# EAGLE design boarduino_2 (EAGLE 8.3.2)
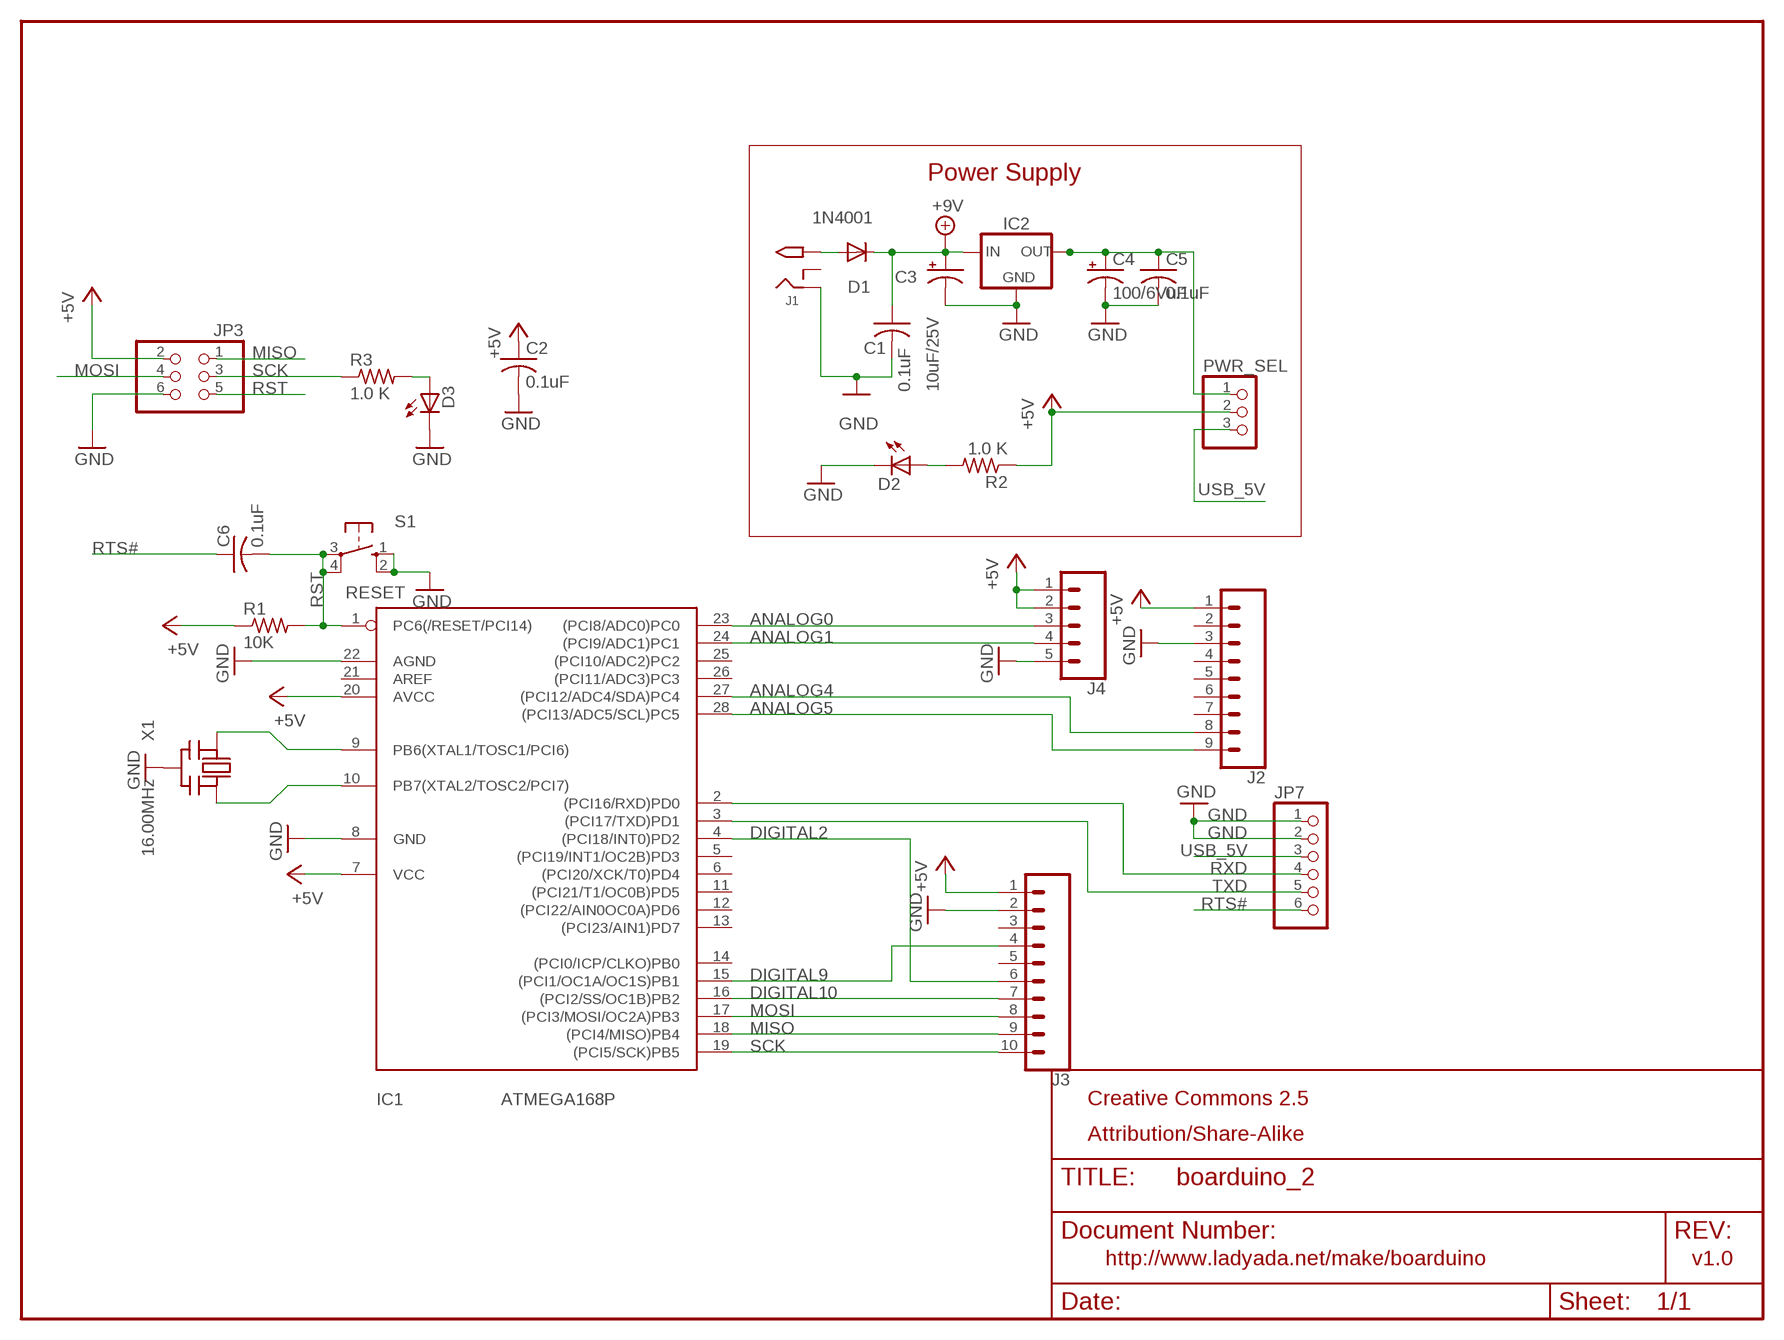
[diagram p0: schematic, sheet 1]

## Parts
C1  0.1uF  C-US025-025X050  [C025-025X050]
C2  0.1uF  C-US025-025X050  [C025-025X050]
C3  10uF/25V  CPOL-USE2.5-6  [E2,5-6]
C4  100/6VuF  CPOL-USE2.5-6  [E2,5-6]
C5  0.1uF  C-US025-025X050  [C025-025X050]
C6  0.1uF  C-US025-025X050  [C025-025X050]
D1  1N4001  1N4004  [DO41-10]
D2  LED3MM  [LED3MM]
D3  Green  LED3MM  [LED3MM]
IC1  ATMEGA168P  ATMEGA168PROUND  [DIL28/3]
IC2  78XXS  [78XXS]
J1  2.1MMJACK  [PJ-102A]
J2  CONN_09  [1X09]
J3  CONN_10"  [1X10]
J4  CONN_05  [1X05]
JP3  PINHD-2X3  [2X03]
JP7  PINHD-1X6CLEAN  [1X06-CLEAN]
PWR_SEL  PINHD-1X3  [1X03]
R1  10K  R-US_0207/5V  [0207/5V]
R2  1.0 K  R-US_0207/5V  [0207/5V]
R3  1.0 K  R-US_0207/5V  [0207/5V]
S1  RESET  10-XX  [B3F-10XX]
X1  16.00MHz  CERMOSCILL  [CERM_OSC]

## Nets
+5V: C2.1 IC1.7(VCC) IC1.20(AVCC) J2.1 J3.1 J4.1 J4.2 JP3.2 PWR_SEL.2 R1.1 R2.1
+9V: C1.1 C3.+ D1.C IC2.IN
ANALOG0: IC1.23((PCI8/ADC0)PC0) J4.3
ANALOG1: IC1.24((PCI9/ADC1)PC1) J4.4
ANALOG4: IC1.27((PCI12/ADC4/SDA)PC4) J2.8
ANALOG5: IC1.28((PCI13/ADC5/SCL)PC5) J2.9
DIGITAL2: IC1.4((PCI18/INT0)PD2) J3.6
DIGITAL9: IC1.15((PCI1/OC1A/OC1S)PB1) J3.4
DIGITAL10: IC1.16((PCI2/SS/OC1B)PB2) J3.7
GND: C1.2 C2.2 C3.- C4.- C5.2 D2.K(C) D3.K(C) IC1.8(GND) IC1.22(AGND) IC2.GND J1.RING J2.3 J3.2 J4.5 JP3.6 JP7.1 JP7.2 S1.1(S) S1.2(S1) X1.P$2(GND)
MISO: IC1.18((PCI4/MISO)PB4) J3.9 JP3.1
MOSI: IC1.17((PCI3/MOSI/OC2A)PB3) J3.8 JP3.4
N$1: IC1.9(PB6(XTAL1/TOSC1/PCI6)) X1.P$1(IN)
N$2: IC1.10(PB7(XTAL2/TOSC2/PCI7)) X1.P$3(OUT)
N$3: D2.A R2.2
N$4: D3.A R3.2
N$17: D1.A J1.TIP
N$22: C4.+ C5.1 IC2.OUT PWR_SEL.1
RST: C6.2 IC1.1(PC6(/RESET/PCI14)) JP3.5 R1.2 S1.3(P) S1.4(P1)
RTS#: C6.1 JP7.6
RXD: IC1.2((PCI16/RXD)PD0) JP7.4
SCK: IC1.19((PCI5/SCK)PB5) J3.10 JP3.3 R3.1
TXD: IC1.3((PCI17/TXD)PD1) JP7.5
USB_5V: JP7.3 PWR_SEL.3
Unconnected: IC1.5((PCI19/INT1/OC2B)PD3) IC1.6((PCI20/XCK/T0)PD4) IC1.11((PCI21/T1/OC0B)PD5) IC1.12((PCI22/AIN0OC0A)PD6) IC1.13((PCI23/AIN1)PD7) IC1.14((PCI0/ICP/CLKO)PB0) IC1.21(AREF) IC1.25((PCI10/ADC2)PC2) IC1.26((PCI11/ADC3)PC3) J1.RING_SW J2.2 J2.4 J2.5 J2.6 J2.7 J3.3 J3.5

## Notes on the sheet
- Power Supply
- Creative Commons 2.5
- Attribution/Share-Alike
- http://www.ladyada.net/make/boarduino | v1.0

## Library data of the parts
C1 C2 C5 C6 = minimidi:C-US: CAPACITOR, American symbol
C3 C4 = minimidi:CPOL-US: POLARIZED CAPACITOR, American symbol
D1 = minimidi:1N4004: DIODE general purpose rectifier, 1 A
D2 D3 = minimidi:LED: LED OSRAM: - CHIPLED LG R971, LG N971, LY N971, LG Q971, LY Q971, LO R971, LY R971 LH N974, LH R974 LS Q976, LO Q976, LY Q976 LO Q996 - Hyper CHIPLED LW Q18S LB Q993, LB Q99A, LB R99A - SideLED LS A670, LO A670, LY A670, LG A670, LP A670 LB A673, LV A673, LT A673, LW A673 LH A674 LY A675 LS A676, LA A676, LO A676, LY A676, LW A676 LS A679, LY A679, LG A679 - Hyper Micro SIDELED® LS Y876, LA Y876, LO Y876, LY Y876 LT Y87S - SmartLED LW L88C, LW L88S LB L89C, LB L89S, LG L890 LS L89K, LO L89K, LY L89K LS L896, LA L896, LO L896, LY L896 - TOPLED LS T670, LO T670, LY T670, LG T670, LP T670 LSG T670, LSP T670, LSY T670, LOP T670, LYG T670 LG T671, LOG T671, LSG T671 LB T673, LV T673, LT T673, LW T673 LH T674 LS T676, LA T676, LO T676, LY T676, LB T676, LH T676, LSB T676, LW T676 LB T67C, LV T67C, LT T67C, LS T67K, LO T67K, LY T67K, LW E67C LS E67B, LA E67B, LO E67B, LY E67B, LB E67C, LV E67C, LT E67C LW T67C LS T679, LY T679, LG T679 LS T770, LO T770, LY T770, LG T770, LP T770 LB T773, LV T773, LT T773, LW T773 LH T774 LS E675, LA E675, LY E675, LS T675 LS T776, LA T776, LO T776, LY T776, LB T776 LHGB T686 LT T68C, LB T68C - Hyper Mini TOPLED® LB M676 - Mini TOPLED Santana® LG M470 LS M47K, LO M47K, LY M47K Source: http://www.osram.convergy.de/
IC1 = avr:ATMEGA168*P: MICROCONTROLLER 16 kBytes FLASH 1 kBytes SRAM 512 Bytes EEPROM USART 8-channel 10 bit ADC
IC2 = v-reg:78XXS: VOLTAGE REGULATOR
J1 = minimidi:2.1MMJACK
J2 = SparkFun-Connectors:CONN_09: Multi connection point. Often used as Generic Header-pin footprint for 0.1 inch spaced/style header connections On any of the 0.1 inch spaced packages, you can populate with these: Break Away Headers - Straight <https://www.sparkfun.com/products/116> (PRT-00116) Break Away Male Headers - Right Angle <https://www.sparkfun.com/products/553> (PRT-00553) Female Headers <https://www.sparkfun.com/products/115> (PRT-00115) Break Away Headers - Machine Pin <https://www.sparkfun.com/products/117> (PRT-00117) Break Away Female Headers - Swiss Machine Pin <https://www.sparkfun.com/products/743> (PRT-00743) For SCREWTERMINALS and SPRING TERMINALS visit here: Screw Terimnals on SparkFun.com <https://www.sparkfun.com/search/results?term=Screw+Terminals> (5mm/3.5mm/2.54mm spacing) This device is also useful as a general connection point to wire up your design to another part of your project. Our various solder wires solder well into these plated through hole pads. Hook-Up Wire - Assortment (Stranded, 22 AWG) <https://www.sparkfun.com/products/11375> (PRT-11375) Hook-Up Wire - Assortment (Solid Core, 22 AWG) <https://www.sparkfun.com/products/11367> (PRT-11367) View the entire wire category on our website here <https://www.sparkfun.com/categories/141> Special notes: Molex polarized connector foot print use with SKU : PRT-08231 with associated crimp pins and housings. 1MM SMD Version SKU: PRT-10208 NOTES ON THE VARIANTS LOCK and LOCK_LONGPADS... This footprint was designed to help hold the alignment of a through-hole component (i.e. 6-pin header) while soldering it into place. You may notice that each hole has been shifted either up or down by 0.005 of an inch from it's more standard position (which is a perfectly straight line). This slight alteration caused the pins (the squares in the middle) to touch the edges of the holes. Because they are alternating, it causes a "brace" to hold the component in place. 0.005 has proven to be the perfect amount of "off-center" position when using our standard breakaway headers. Although looks a little odd when you look at the bare footprint, once you have a header in there, the alteration is very hard to notice. Also,if you push a header all the way into place, it is covered up entirely on the bottom side.
J3 = SparkFun-Connectors:CONN_10: Multi connection point. Often used as Generic Header-pin footprint for 0.1 inch spaced/style header connections On any of the 0.1 inch spaced packages, you can populate with these: Break Away Headers - Straight <https://www.sparkfun.com/products/116> (PRT-00116) Break Away Male Headers - Right Angle <https://www.sparkfun.com/products/553> (PRT-00553) Female Headers <https://www.sparkfun.com/products/115> (PRT-00115) Break Away Headers - Machine Pin <https://www.sparkfun.com/products/117> (PRT-00117) Break Away Female Headers - Swiss Machine Pin <https://www.sparkfun.com/products/743> (PRT-00743) Arduino Stackable Header - 10 Pin <https://www.sparkfun.com/products/11376> (PRT-11376) For SCREWTERMINALS and SPRING TERMINALS visit here: Screw Terimnals on SparkFun.com <https://www.sparkfun.com/search/results?term=Screw+Terminals> (5mm/3.5mm/2.54mm spacing) This device is also useful as a general connection point to wire up your design to another part of your project. Our various solder wires solder well into these plated through hole pads. Hook-Up Wire - Assortment (Stranded, 22 AWG) <https://www.sparkfun.com/products/11375> (PRT-11375) Hook-Up Wire - Assortment (Solid Core, 22 AWG) <https://www.sparkfun.com/products/11367> (PRT-11367) View the entire wire category on our website here <https://www.sparkfun.com/categories/141> Special notes: Molex polarized connector foot print use with SKU : PRT-08231 with associated crimp pins and housings. 1MM SMD Version SKU: PRT-10208 NOTES ON THE VARIANTS LOCK and LOCK_LONGPADS... This footprint was designed to help hold the alignment of a through-hole component (i.e. 6-pin header) while soldering it into place. You may notice that each hole has been shifted either up or down by 0.005 of an inch from it's more standard position (which is a perfectly straight line). This slight alteration caused the pins (the squares in the middle) to touch the edges of the holes. Because they are alternating, it causes a "brace" to hold the component in place. 0.005 has proven to be the perfect amount of "off-center" position when using our standard breakaway headers. Although looks a little odd when you look at the bare footprint, once you have a header in there, the alteration is very hard to notice. Also,if you push a header all the way into place, it is covered up entirely on the bottom side.; PROD_ID: CONN-11563
J4 = SparkFun-Connectors:CONN_05: Multi connection point. Often used as Generic Header-pin footprint for 0.1 inch spaced/style header connections On any of the 0.1 inch spaced packages, you can populate with these: Break Away Headers - Straight <https://www.sparkfun.com/products/116> (PRT-00116) Break Away Male Headers - Right Angle <https://www.sparkfun.com/products/553> (PRT-00553) Female Headers <https://www.sparkfun.com/products/115> (PRT-00115) Break Away Headers - Machine Pin <https://www.sparkfun.com/products/117> (PRT-00117) Break Away Female Headers - Swiss Machine Pin <https://www.sparkfun.com/products/743> (PRT-00743) For SCREWTERMINALS and SPRING TERMINALS visit here: Screw Terimnals on SparkFun.com <https://www.sparkfun.com/search/results?term=Screw+Terminals> (5mm/3.5mm/2.54mm spacing) This device is also useful as a general connection point to wire up your design to another part of your project. Our various solder wires solder well into these plated through hole pads. Hook-Up Wire - Assortment (Stranded, 22 AWG) <https://www.sparkfun.com/products/11375> (PRT-11375) Hook-Up Wire - Assortment (Solid Core, 22 AWG) <https://www.sparkfun.com/products/11367> (PRT-11367) View the entire wire category on our website here <https://www.sparkfun.com/categories/141> Special notes: Molex polarized connector foot print use with SKU : PRT-08231 with associated crimp pins and housings. 1MM SMD Version SKU: PRT-10208
JP3 = pinhead-ez:PINHD-2X3: PIN HEADER
JP7 = carduino:PINHD-1X6: PIN HEADER
PWR_SEL = pinhead:PINHD-1X3: PIN HEADER
R1 = rcl-ez:R-US_: RESISTOR, American symbol
R2 R3 = minimidi:R-US_: RESISTOR, American symbol
S1 = switch-omron:10-XX: OMRON SWITCH
X1 = digg:CERMOSCILL

## Board
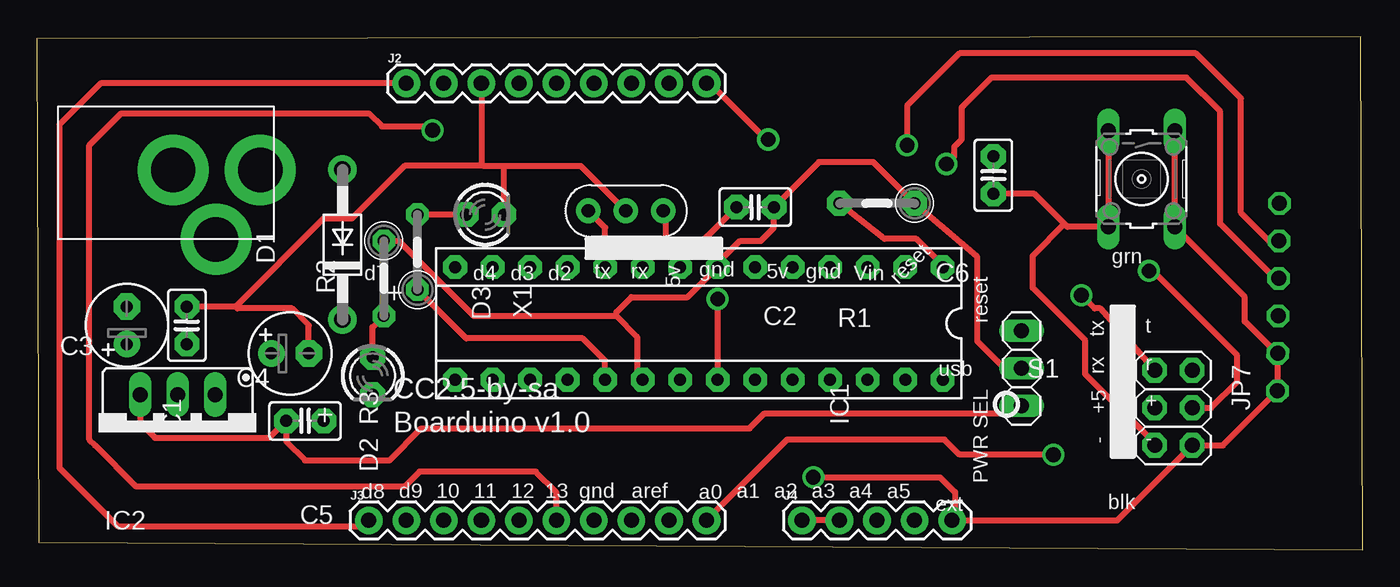
[diagram p1: board, top side]
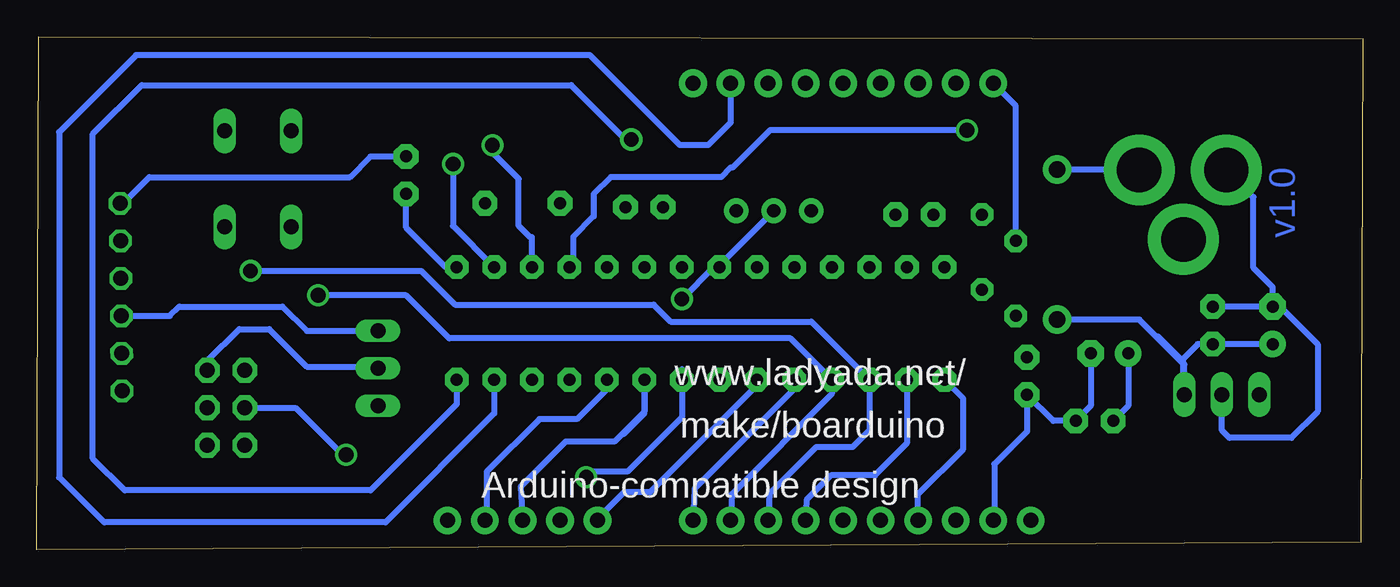
[diagram p2: board, bottom side, seen from below]

Size 89.77 x 34.72 mm. Coordinates in mm from the lower left corner, seen from the top.
Outline: 0.13,0.51 89.77,0 89.64,34.72 0,34.59 0.13,0.51
Copper layers (1*16): Top 0.035mm / dielectric 1.5mm / Bottom 0.035mm
Design rules "default": minimum track width 10mil, minimum drill 19mil, track to track 10mil, track to pad 10mil, pad to pad 10mil, via to via 10mil, smd to smd 0mil, copper to edge 10mil, drill to drill 8mil, minimum pad ring 10mil, minimum via ring 8mil, stop-mask expansion 4mil, vias tented up to drill 0mil, thermal gap 10mil

### Footprints (pad centres in the part's own frame; a part is rotated, then mirrored left to right if it is on the bottom)
C025-025X050 = drill 0.813 pad 1.676 octagon: 1 -1.27,0; 2 1.27,0
E2,5-6 = drill 0.813 pad 1.778: + -1.27,0 | drill 0.813 pad 1.778 octagon: - 1.27,0
DO41-10 = drill 1.118 pad 1.93: A 5.08,0; C -5.08,0
LED3MM = drill 0.813 pad 1.676 octagon: A -1.27,0; K 1.27,0
DIL28/3 = drill 0.813 pad 1.6 octagon: 1 -16.51,-3.81; 2 -13.97,-3.81; 3 -11.43,-3.81; 4 -8.89,-3.81; 5 -6.35,-3.81; 6 -3.81,-3.81; 7 -1.27,-3.81; 8 1.27,-3.81; 9 3.81,-3.81; 10 6.35,-3.81; 11 8.89,-3.81; 12 11.43,-3.81; 13 13.97,-3.81; 14 16.51,-3.81; 15 16.51,3.81; 16 13.97,3.81; 17 11.43,3.81; 18 8.89,3.81; 19 6.35,3.81; 20 3.81,3.81; 21 1.27,3.81; 22 -1.27,3.81; 23 -3.81,3.81; 24 -6.35,3.81; 25 -8.89,3.81; 26 -11.43,3.81; 27 -13.97,3.81; 28 -16.51,3.81
78XXS = drill 1.016 long: GND 0,-2.54; IN -2.54,-2.54; OUT 2.54,-2.54
PJ-102A = drill 3 pad 4.8: RING 0.1,-3.39; RING_SW -4.6,-6.29; TIP 0.1,-9.29
1X09 = drill 1.016 pad 1.88: 1 0,0; 2 2.54,0; 3 5.08,0; 4 7.62,0; 5 10.16,0; 6 12.7,0; 7 15.24,0; 8 17.78,0; 9 20.32,0
1X10 = drill 1.016 pad 1.88: 1 0,0; 2 2.54,0; 3 5.08,0; 4 7.62,0; 5 10.16,0; 6 12.7,0; 7 15.24,0; 8 17.78,0; 9 20.32,0; 10 22.86,0
1X05 = drill 1.016 pad 1.88: 1 0,0; 2 2.54,0; 3 5.08,0; 4 7.62,0; 5 10.16,0
2X03 = drill 1.016 pad 1.676 octagon: 1 -2.54,-1.27; 2 -2.54,1.27; 3 0,-1.27; 4 0,1.27; 5 2.54,-1.27; 6 2.54,1.27
1X06-CLEAN = drill 1.016 octagon: 1 -6.35,0; 2 -3.81,0; 3 -1.27,0; 4 1.27,0; 5 3.81,0; 6 6.35,0
1X03 = drill 1.016 long: 1 -2.54,0; 2 0,0; 3 2.54,0
0207/5V = drill 0.813 pad 1.676 octagon: 1 -2.54,0; 2 2.54,0
0207/5V' = drill 0.813 pad 1.524 octagon: 1 -2.54,0; 2 2.54,0
B3F-10XX = drill 1.016 long: 1 -3.251,2.261; 2 3.251,2.261; 3 -3.251,-2.261; 4 3.251,-2.261
CERM_OSC = drill 0.9 pad 1.676: P$1 -2.54,0; P$2 0,0; P$3 2.54,0

### Placement (x,y rotation side)
C1  10.16,15.2 90 top
C2  48.64,23.2 180 top
C3  6.09,15.2 90 top
C4  17.14,13.3 0 top
C5  18.16,8.72 0 top
C6  64.77,25.36 270 top
D1  20.7,20.66 90 top
D2  22.73,11.77 270 top
D3  30.35,22.7 0 top
IC1  44.83,15.33 180 top
IC2  9.52,7.96 180 top
J1  5.84,25.62 90 top
J2  25.01,31.59 0 top
J3  22.47,1.99 0 top
J4  51.81,1.99 0 top
JP3  76.96,9.61 270 top
JP7  84.07,17.11 89.4 top
PWR_SEL  66.67,12.28 90 top
R1  56.89,23.46 180 top
R2  1.0 K  [0207/5V']  23.49,18.38 270 top
R3  1.0 K  [0207/5V']  25.78,20.15 90 top
S1  74.8,25.11 270 top
X1  39.87,22.95 180 top

### Tracks (layer width: path | path; a pad name or v marks a point on that pad's centre or on a via)
+5V
  Top 0.305: 46.1,19.39 IC1.7
  Top 0.406: J4.2 J4.1 | R2.1 24.51,20.92 29.59,15.84 39.24,15.84 | 39.24,15.84 40.64,14.44 40.64,11.9 IC1.20 | 39.24,15.84 39.24,16.09 40.25,17.11 44.06,17.11 IC1.7 46.1,19.39 47.62,20.92 49.02,20.92 49.91,21.81 C2.1 52.95,26.25 56.64,26.25 R1.1 63.69,19.84 63.69,14.12 65.53,12.28 PWR_SEL.2 | J2.1 4.31,31.59 1.52,28.79 1.52,5.55 5.46,1.61 22.09,1.61 J3.1
  Bottom 0.406: J4.1 51.74,2.17 50.02,3.9 48.26,3.9 41.02,11.14 IC1.20 | JP3.2 78.23,12.79 76.07,14.95 74.04,14.95 71.5,12.41 66.8,12.41 PWR_SEL.2 | R2.1 23.49,30.06 J2.1
+9V
  Bottom 0.406: C3.+ C1.1 11.17,13.93 12.19,12.92 | 12.19,12.92 12.19,10.63 IC2.IN 12.06,12.54 15.11,15.58 D1.C | 12.19,12.92 12.31,12.92 13.84,14.44
ANALOG0
  Bottom 0.406: J4.3 57.02,4.28 53.97,7.33 50.67,7.33 48.64,9.36 IC1.23 48.64,9.23 50.03,7.84
ANALOG1
  Bottom 0.406: J4.4 59.44,2.14 59.3,2.28 59.3,5.3 55.75,8.85 53.21,8.85 51.18,10.88 IC1.24
ANALOG4
  Bottom 0.406: IC1.27 58.8,9.23 66.16,1.87 85.21,1.87 88.26,4.92 88.26,28.28 83.05,33.49 52.32,33.49 46.22,27.39 44.32,27.39 42.79,28.92 J2.8
ANALOG5  (via drill 1 pad 1.3)
  Top 0.406: v49.52,27.77 49.4,27.77 45.59,31.59 J2.9
  Bottom 0.406: v49.52,27.77 49.65,27.9 50.03,27.9 53.59,31.46 82.67,31.46 85.97,28.16 85.97,6.19 83.81,4.03 67.18,4.03 61.34,9.87 IC1.28
DIGITAL2  (via drill 1 pad 1.3)
  Top 0.406: J3.6 35.17,3.9 33.78,5.3 25.9,5.3 24.89,4.28 6.73,4.28 3.93,7.07 3.55,7.46 3.55,27.39 5.71,29.55 22.47,29.55 23.36,28.66 26.54,28.66 v26.79,28.41
  Bottom 0.406: v26.79,28.41 40.13,28.41 42.67,25.87 42.79,25.87 43.43,25.23 50.92,25.23 52.07,24.09 52.07,22.57 53.46,21.17 53.46,19.39 IC1.4
DIGITAL9
  Bottom 0.305: IC1.15 28.06,11.52 28.57,11.01
  Bottom 0.406: J3.4 30.09,3.77 27.05,6.82 27.05,10.25 IC1.15
DIGITAL10
  Bottom 0.305: 30.98,11.14 31.11,11.01
  Bottom 0.406: 30.98,11.14 30.86,11.26 IC1.16 30.86,7.2 33.02,5.04 36,5.04 37.66,3.39 J3.7
GND  (via drill 1 pad 1.3)
  Top 0.406: v46.1,16.98 IC1.22 | v52.57,4.92 61.16,4.92 62.17,3.91 62.17,2.19 J4.5 73.15,1.99 JP3.6 80.32,7.07 JP7.1 84.03,10.78 JP7.2 83.96,13.3 81.78,15.47 81.78,17.13 S1.2 S1.1 | 13.46,16.47 C1.2 | 13.46,16.47 19.43,22.44 21.33,22.44 24.89,26 30.22,26 | 30.22,26 31.62,26 | 31.62,26 36.83,26 X1.P$2 | D3.K 31.62,26 | J2.3 30.09,26.12 30.22,26 | C4.- 18.41,15.2 17.27,16.34 13.58,16.34 13.46,16.47 | IC1.8 43.56,19.39 C2.2
  Bottom 0.305: 43.3,19.14 IC1.8 | 46.1,12.28 IC1.22
  Bottom 0.406: J3.2 25.01,2.25 24.94,2.32 24.94,5.8 22.73,8.01 D2.K 20.95,8.72 C5.2 18.41,9.74 C4.- | C3.- 5.58,16.47 3.04,13.93 3.04,9.36 4.82,7.58 9.01,7.58 9.52,8.09 IC2.GND | C3.- C1.2 | J1.RING 7.4,23.88 7.4,19.09 6.09,17.79 C3.- | IC1.22 46.1,8.98 49.78,5.3 52.19,5.3 v52.57,4.92 | X1.P$2 43.56,19.27 IC1.8 43.94,19.14 v46.1,16.98
MISO  (via drill 1 pad 1.3)
  Top 0.406: JP3.1 72,16.34 71.62,16.34 v70.73,17.23
  Bottom 0.406: v70.73,17.23 64.77,17.23 61.84,14.31 38.73,14.31 IC1.18 35.94,10.55 42.72,3.77 J3.9
MOSI  (via drill 1 pad 1.3)
  Top 0.406: JP3.4 79.5,9.61 81.27,11.39 81.27,13.17 75.69,18.76 75.43,18.76 v75.31,18.88
  Bottom 0.406: 62.92,18.06 63.75,18.88 | 62.92,18.06 61.46,16.6 48,16.6 46.86,15.46 37.33,15.46 IC1.17 33.4,8.09 34.54,6.95 37.01,6.95 40.17,3.79 J3.8 | v75.31,18.88 63.75,18.88 | 63.75,18.88 62.92,18.06
N$1
  Top 0.406: IC1.9 42.6,20.73 42.6,22.76 X1.P$1
N$2
  Top 0.406: IC1.10 38.48,21.81 X1.P$3
N$3
  Top 0.406: D2.A 22.73,15.07 R2.2
N$4
  Top 0.305: R3.2 25.52,22.7
  Top 0.406: D3.A R3.2
N$17
  Bottom 0.406: J1.TIP 20.67,25.72 D1.A
N$22
  Top 0.406: IC2.OUT 6.98,8.6 8,7.58 15.74,7.58 C5.1 16.89,7.33 18.16,6.06 23.87,6.06 26.03,8.22 48.26,8.22 49.27,9.23 66.16,9.23 PWR_SEL.1
  Bottom 0.406: C4.+ 15.87,9.74 C5.1
RST
  Top 0.406: IC1.1 61.34,19.27 59.56,21.04 57.4,21.04 R1.2 | C6.2 67.56,24.09 69.59,22.06 | S1.3 S1.4 69.79,21.86 69.59,22.06 | JP3.5 75.69,7.2 70.99,11.9 70.99,14.19 67.43,17.74 67.43,19.9 69.59,22.06
  Bottom 0.406: 61.72,19.52 IC1.1 62.1,19.14 64.77,21.81 C6.2
RTS#
  Bottom 0.406: C6.1 67.18,26.63 68.57,25.23 82.16,25.23 83.94,23.46 JP7.6
RXD  (via drill 1 pad 1.3)
  Top 0.406: JP7.4 83.81,18.38 80.13,22.06 80.13,29.68 77.85,31.97 64.64,31.97 62.61,29.93 62.61,27.77 62.1,27.27 62.1,26.63 v61.59,26.12
  Bottom 0.406: v61.59,26.12 61.59,21.93 IC1.2
SCK  (via drill 1 pad 1.3)
  Top 0.406: IC1.19 38.48,12.79 36.95,14.31 29.08,14.31 R3.1 | J3.10 50.8,7.46 61.46,7.46 62.48,6.44 v68.83,6.44
  Bottom 0.406: J3.10 45.24,4.15 38.48,10.91 IC1.19 | JP3.3 72.26,9.61 69.21,6.57 68.96,6.57 v68.83,6.44
TXD  (via drill 1 pad 1.3)
  Top 0.406: JP7.5 83.43,20.92 81.53,22.82 81.53,30.57 78.48,33.62 62.48,33.62 58.92,30.06 v58.92,27.39
  Bottom 0.406: v58.92,27.39 58.92,26.89 57.15,25.11 57.15,21.93 56.38,21.17 56.26,21.17 IC1.3
USB_5V
  Bottom 0.406: PWR_SEL.3 71.5,14.82 73.15,16.47 80.13,16.47 80.77,15.84 JP7.3

### Text on the board
Bottom: v1.0
tPlace: D1 | d7 | d4 | d3 | d2 | tx | rx | 5v | gnd | Vin | C6 | grn | gnd | 5v | reset | reset | R2 | + | C2 | D3 | X1 | R1 | C3 | tx | t | usb | C4 | rx | r | S1 | CC2.5-by-sa | +5 | + | C1 | + | R3 | Boarduino v1.0 | IC1 | - | - | D2 | PWR SEL | C5 | d8 | d9 | 10 | 11 | 12 | 13 | gnd | aref | a0 | a1 | a2 | a3 | a4 | a5 | blk | ext | IC2
bPlace: www.ladyada.net/ | make/boarduino | Arduino-compatible design